# Altium schematic sheet QiTian Mini Remote Control.SchDoc
size A4; SheetNumber: 1; SheetTotal: 1
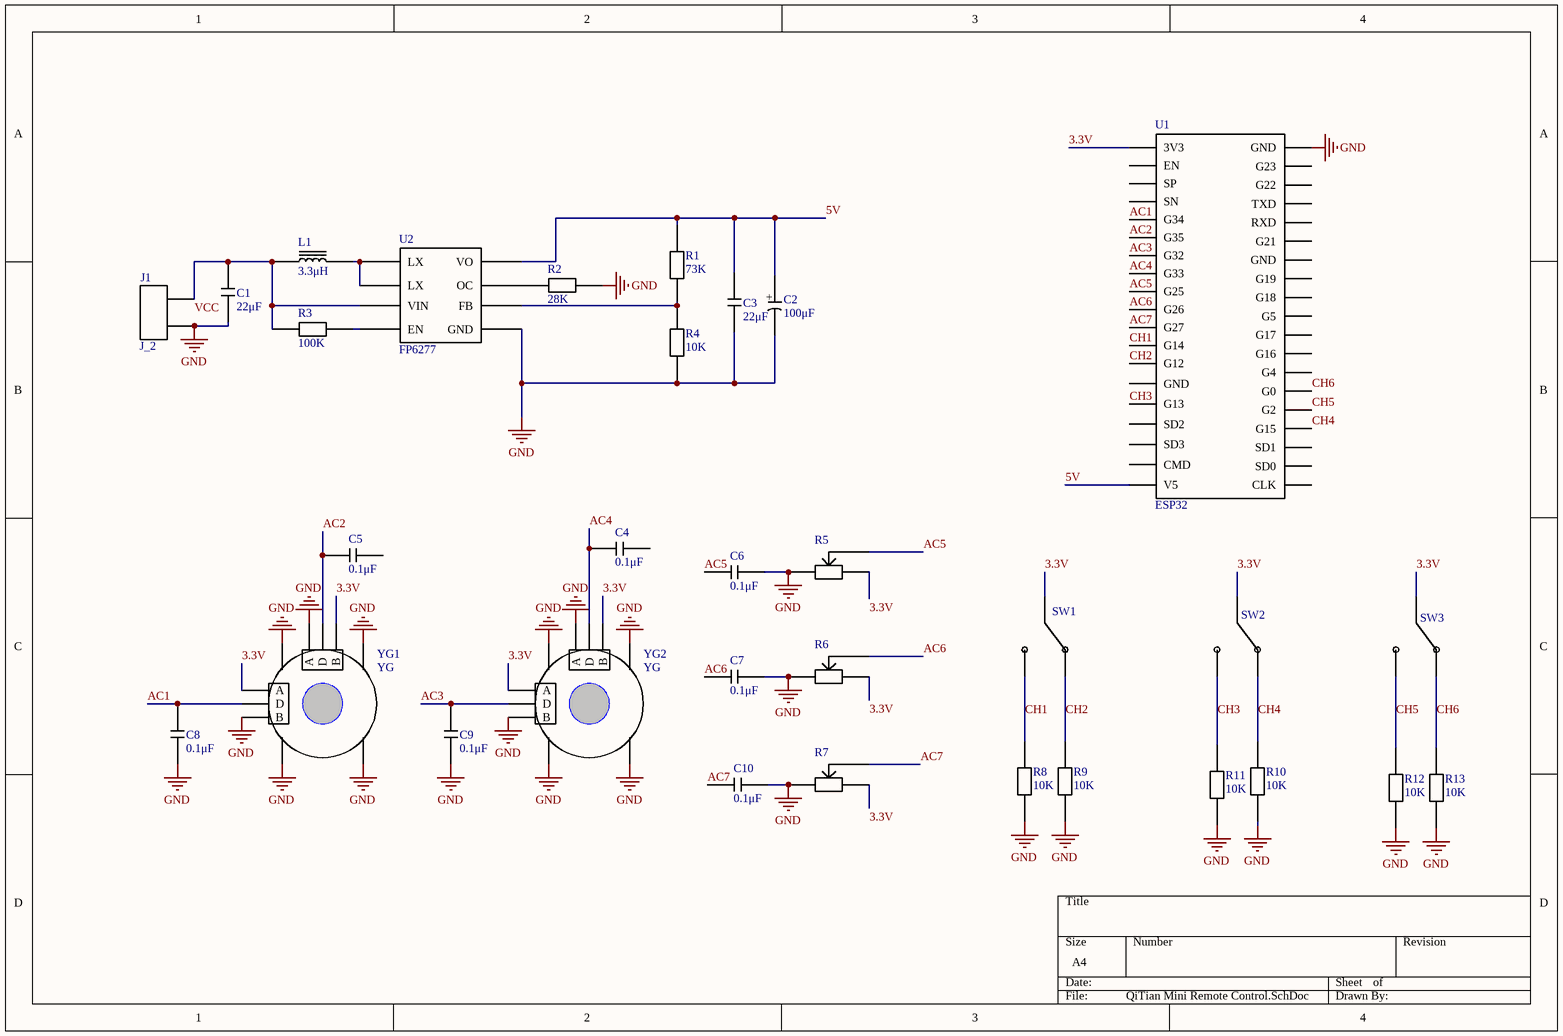
[diagram p0: QiTian Mini Remote Control.SchDoc]

## Parts
C1  22μF  [6032]
C2  100μF  [63_54]
C3  22μF  [6032]
C4  0.1μF  [0603]
C5  0.1μF  [0603]
C6  0.1μF  [0603]
C7  0.1μF  [0603]
C8  0.1μF  [0603]
C9  0.1μF  [0603]
C10  0.1μF  [0603]
J1  J_2  [J_2]
L1  3.3μH  [0630]
R1  73K  [0603]
R2  28K  [0603]
R3  100K  [0603]
R4  10K  [0603]
R5  RH  [RH3]  (value not drawn)
R6  RH  [RH3]  (value not drawn)
R7  RH  [RH3]  (value not drawn)
R8  10K  [0603]
R9  10K  [0603]
R10  10K  [0603]
R11  10K  [0603]
R12  10K  [0603]
R13  10K  [0603]
SW1  SW_3  [SW3]  (value not drawn)
SW2  SW_3  [SW3]  (value not drawn)
SW3  SW_3  [SW3]  (value not drawn)
U1  ESP32  [ESP32]
U2  FP6277  [FP6277]
YG1  YG  [YG]
YG2  YG  [YG]

## Nets
GND: C1.2 C2.1(+) C3.1 C6.2 C7.2 C8.1 C9.1 C10.2 J1.2 R2.2 R4.2 R5.1 R6.1 R7.1 R8.1 R9.2 R10.1 R11.1 R12.1 R13.1 U1.20(GND) U2.5(GND) YG1.1(B) YG1.4(A) YG1.7 YG1.8 YG1.9 YG1.10 YG2.1(B) YG2.4(A) YG2.7 YG2.8 YG2.9 YG2.10
3.3V: R5.2 R6.2 R7.2 SW1.1 SW2.1 SW3.1 U1.1(3V3) YG1.3(A) YG1.6(B) YG2.3(A) YG2.6(B)
5V: C2.2(-) C3.2 R1.1 U1.19(V5) U2.8(VO)
AC1: C8.2 U1.5(G34) YG1.2(D)
AC2: C5.1 U1.6(G35) YG1.5(D)
AC3: C9.2 U1.7(G32) YG2.2(D)
AC4: C4.1 U1.8(G33) YG2.5(D)
AC5: C6.1 R5.3 U1.9(G25)
AC6: C7.1 R6.3 U1.10(G26)
AC7: C10.1 R7.3 U1.11(G27)
CH1: R8.2 SW1.2 U1.12(G14)
CH2: R9.1 SW1.3 U1.13(G12)
CH3: R11.2 SW2.2 U1.15(G13)
CH4: R10.2 SW2.3 U1.35(G15)
CH5: R12.2 SW3.2 U1.34(G2)
CH6: R13.2 SW3.3 U1.33(G0)
VCC: C1.1 J1.1 L1.1 R3.1 U2.3(VIN)
NetL1_2: L1.2 U2.1(LX) U2.2(LX)
NetR1_2: R1.2 R4.1 U2.6(FB)
NetR2_1: R2.1 U2.7(OC)
NetR3_2: R3.2 U2.4(EN)

Not connected (* = marked no-connect by the designer): C4 2; C5 2; U1 2(EN) 3(SP) 4(SN) 14(GND) 16(SD2) 17(SD3) 18(CMD) 21(G23) 22(G22) 23(TXD) 24(RXD) 25(G21) 26(GND) 27(G19) 28(G18) 29(G5) 30(G17) 31(G16) 32(G4) 36(SD1) 37(SD0) 38(CLK)

## Library data of the parts
C1 C3-C10 = C
C2 = C_1: 电解电容
L1 = L
R1-R4 R8-R13 = R
R5-R7 = RH: 可调电阻
SW1-SW3 = SW_3: 三段开关
U1 = U_ESP32: ESP32开发底板
U2 = U_FP6277: 5V 3A升压芯片
YG1 YG2 = YG: 摇杆